# Altium schematic sheet RP_ComputeModule3_rev.3.0_USB.SchDoc
size A4 portrait
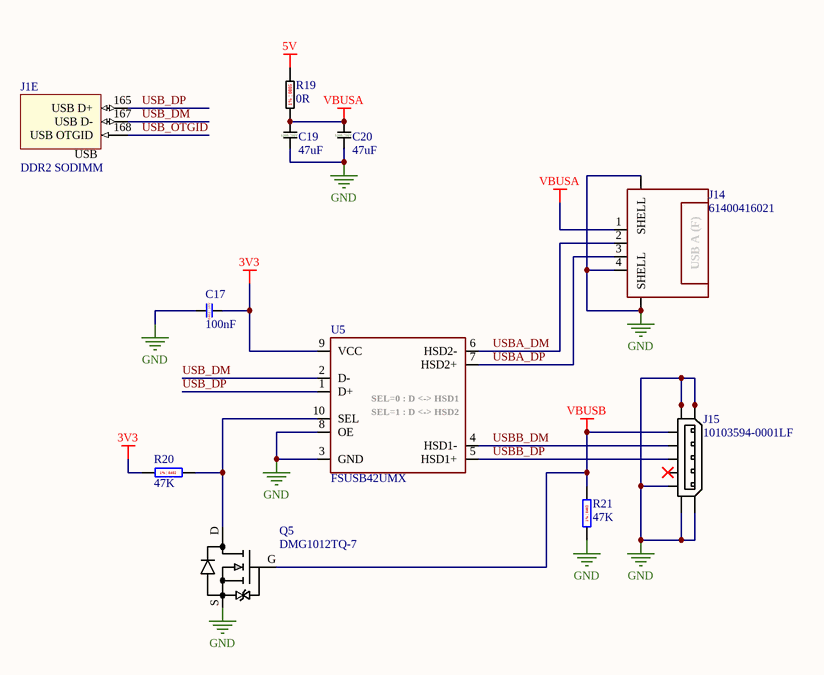
[diagram p0: RP_ComputeModule3_rev.3.0_USB.SchDoc]

## Parts
C17  100nF  [GJM 0402 C]
C19  47uF  [MURATA C1206 / CAPC3216X94N]
C20  47uF  [MURATA C1206 / CAPC3216X94N]
J1  DDR2 SODIMM  [TE 1473005-4 (DDR2 SO-DIMM)]  (part E of 14)
J14  61400416021  [WE USB connector 61400416021]
J15  10103594-0001LF  [FCI_10103594-0001LF]
Q5  DMG1012TQ-7  [Diodes SOT523]
R19  0R  [YAGEO RES0402]
R20  47K  [Vishay Beyschlag MCS0402]
R21  47K  [Vishay Beyschlag MCS0402]
U5  FSUSB42UMX  [Fairchild/OnSemi - UMLP (FSUSB42)]

## Nets
3V3: C17.1 R20.2 U5.9(VCC)
5V: R19.1
GND: C17.2 C19.1 C20.1 J14.4 J14.SHELL J14.SHELL2(SHELL) J15.1 J15.6 J15.7 J15.8 J15.9 J15.10 J15.11 Q5.S R21.2 U5.3(GND) U5.8(OE)
VBUSA: C19.2 C20.2 J14.1 R19.2
VBUSB: J15.5 Q5.G R21.1
USB_DM: J1.167(USB_D-) U5.2(D-)
USB_DP: J1.165(USB_D+) U5.1(D+)
USB_OTGID: J1.168(USB_OTGID)
USBA_DM: J14.2 U5.6(HSD2-)
USBA_DP: J14.3 U5.7(HSD2+)
USBB_DM: J15.4 U5.4(HSD1-)
USBB_DP: J15.3 U5.5(HSD1+)
NetQ5_D: Q5.D R20.1 U5.10(SEL)

Not connected (* = marked no-connect by the designer): J15 2*

## Notes on the sheet
- (in symbol 1473005-4, part E) USB
- (in symbol 61400416021) USB A (F)
- (in symbol AC0805FR-070RL) 1% | 0805
- (in symbol C3216JB1C476M160AB) 1206 | 16V
- (in symbol FSUSB42UMX) SEL=0 : D <-> HSD1; SEL=1 : D <-> HSD2
- (in symbol GRM155R71A104JA01D) 0402 | 10V
- (in symbol MCS04020C4702FE000) 1% | 0402

## Library data of the parts
C17 = GRM155R71A104JA01D: Multilayer Ceramic Capacitors MLCC - SMD/SMT 0402 0.1uF 10volts 5%; Manufacturer: Murata Electronics; Type: Chip Monolithic Ceramic Capacitor; Voltage Rating DC: 10 VDC; Capacitance - pF: 100000 pF; Dielectric: X7R; Supplier 1: Mouser; Manufacturer Part Number: GRM155R71A104JA01D; RoHS: RoHS Compliant; Category: Multilayer Ceramic Capacitors MLCC - SMD/SMT; Stock 1: 376; Pricing 1: 1=0.100, 10=0.024, 100=0.011, 500=0.008, 1000=0.006, 5000=0.005, 10000=0.004 (USD); Capacitance: 0.1 uF; Height: 0.5 mm; Length: 1 mm; Package / Case: 0402 (1005 metric); Packaging: Cut Tape; Product: General Type MLCCs; Series: GRM; Termination Style: SMD/SMT; Tolerance: 5 %; Width: 0.5 mm; Brand: Murata Electronics; Capacitance - nF: 100 nF; Case Code - in: 0402; Case Code - mm: 1005; Maximum Operating Temperature: + 125 C; Minimum Operating Temperature: - 55 C; Standard Pack Qty: 10000; RoHS - Mouser: Y; Minimum Order Quantity: 1; Reeling: True; ComponentLink1URL: https://www.mouser.com/ds/2/281/c02e-2905.pdf; ComponentLink1Description: https://www.mouser.com/ds/2/281/c02e-2905.pdf
C19 C20 = C3216JB1C476M160AB: 47µF ±20% 16V JB Ceramic Capacitor -25°C ~ 85°C Surface Mount, MLCC 1206 (3216 Metric) 0.126" L x 0.063" W (3.20mm x 1.60mm); Manufacturer: TDK; Supplier 1: Digi-Key; Manufacturer Part Number: C3216JB1C476M160AB; Stock 1: 203837; Pricing 1: 1=1.2, 10=0.949, 100=0.7116, 500=0.53762, 1000=0.47438 (USD); Mount: Surface Mount; Case/Package: 1206; Case Code (Metric): 3216; Case Code (Imperial): 1206; Dielectric Material: Ceramic; Min Operating Temperature: -25°C; Max Operating Temperature: 85°C; Package Quantity: 1; Packaging: Tape and Reel; Capacitance: 47uF; Tolerance: 20%; Voltage Rating: 16V; Termination: SMD/SMT; Composition: Ceramic; Voltage Rating (DC): 16V; Length: 0.126inch; Height: 1.6mm; Width: 0.063inch; Thickness: 0.069inch; Lead Free: Lead Free; ComponentLink1URL: https://product.tdk.com/en/products/common/pdf/mlcc_partnumber_description.pdf; ComponentLink1Description: https://product.tdk.com/en/products/common/pdf/mlcc_partnumber_description.pdf; ComponentLink2URL: http://product.tdk.com/en/catalog/datasheets/mlcc_commercial_general_en.pdf; ComponentLink2Description: http://product.tdk.com/en/catalog/datasheets/mlcc_commercial_general_en.pdf; ComponentLink3URL: http://www.mouser.com/ds/2/400/lcc_commercial_general_en-837201.pdf; ComponentLink3Description: http://www.mouser.com/ds/2/400/lcc_commercial_general_en-837201.pdf
J1 = 1473005-4: TE CONNECTIVITY / AMP         1473005-4             SOCKET IC, DIMM, DDR2, 1.8V, 200WAY; Number of Contacts: 200; Memory Type: SDRAM,DDR; Insulation Resistance: 250MR; PCB Mount Retention: With; Gender: Female; Contact Current Rating: 500mA; Circuit Application: Power; Connector System: Cable-to-Board; Sealable: No (Without); Pitch: 0.6mm; Row Spacing: 0.244inch; Stack Height: 5.2mm; Supplier 1: Digi-Key; Manufacturer: TE Connectivity; Manufacturer Part Number: 1473005-4; Stock 1: 3804; Pricing 1: 1=3.9, 10=3.744, 25=3.432, 50=3.276, 100=3.12, 250=2.73, 500=2.652, 1000=2.262, 2500=2.106 (USD); Mount: Surface Mount; Number of Pins: 200; Contact Material: Copper Alloy; Contact Plating: Gold; Housing Colour: Black; Housing Material: Thermoplastic; Insulation Material: Thermoplastic; Min Operating Temperature: -67°C; Max Operating Temperature: 185°C; Number of Rows: 2; Orientation: Right Angle; Termination: Solder; Packaging: Tray; Package Quantity: 20; Number of Positions: 200; Voltage Rating: 1.8V; Connector Type: Socket; Length: 71.5mm; Depth: 26mm; Radiation Hardening: No; ELV: Compliant; Flammability Rating: UL94 V-0; Lead Free: Lead Free; REACH SVHC: No SVHC; ComponentLink1URL: https://datasheet.ciiva.com/682/eng-cd-1473005-j2-682720.pdf; ComponentLink1Description: https://datasheet.ciiva.com/682/eng-cd-1473005-j2-682720.pdf; ComponentLink2URL: https://datasheet.ciiva.com/15171/getdatasheetpartid-99150-15171488.pdf; ComponentLink2Description: https://datasheet.ciiva.com/15171/getdatasheetpartid-99150-15171488.pdf; ComponentLink3URL: https://datasheet.ciiva.com/1105/582309-1105221.pdf; ComponentLink3Description: https://datasheet.ciiva.com/1105/582309-1105221.pdf; ComponentLink4URL: https://datasheet.ciiva.com/682/eng-cd-1473005-j2-682726.pdf; ComponentLink4Description: https://datasheet.ciiva.com/682/eng-cd-1473005-j2-682726.pdf; ComponentLink5URL: https://datasheet.ciiva.com/14156/04821302-14156311.pdf; ComponentLink5Description: https://datasheet.ciiva.com/14156/04821302-14156311.pdf; ComponentLink6URL: https://datasheet.ciiva.com/3136/eng-cd-1473005-j-3136060.pdf; ComponentLink6Description: https://datasheet.ciiva.com/3136/eng-cd-1473005-j-3136060.pdf; ComponentLink7URL: https://datasheet.ciiva.com/16380/eng-cd-1473005-j-16380909.pdf; ComponentLink7Description: https://datasheet.ciiva.com/16380/eng-cd-1473005-j-16380909.pdf; ComponentLink8URL: https://datasheet.ciiva.com/16651/eng-cd-1473005-j-16651646.pdf; ComponentLink8Description: https://datasheet.ciiva.com/16651/eng-cd-1473005-j-16651646.pdf
J14 = 61400416021: USB - A USB 2.0 Receptacle Connector 4 Position Through Hole, Right Angle, Horizontal; Manufacturer: Wurth Electronics; Connector Type: USB,Socket; Number of Contacts: 4; Current Rating: 1A; Voltage Rating: 30V; Number of Ports: 1; Insulation Resistance: 1GR; USB Standard: USB 2.0; Supplier 1: Mouser; Manufacturer Part Number: 61400416021; Stock 1: 1100; Pricing 1: 1=0.99, 10=0.874, 50=0.823, 100=0.739, 1000=0.672, 10000=0.672 (USD); Mount: Through Hole,Horizontal; Contact Plating: Gold; Contact Material: Copper Alloy; Colour: White; Min Operating Temperature: -40°C; Max Operating Temperature: 105°C; Packaging: Tray; Gender: Receptacle; Package Quantity: 60; Number of Positions: 4; Termination: Solder; Orientation: Right Angle; Length: 15.8mm; Width: 14.4mm; REACH SVHC: Unknown; Lead Free: Lead Free; Flammability Rating: UL94 V-0; ComponentLink1URL: https://datasheet.ciiva.com/851/61400416021-851760.pdf; ComponentLink1Description: https://datasheet.ciiva.com/851/61400416021-851760.pdf; ComponentLink2URL: https://datasheet.ciiva.com/1098/1712150-1098928.pdf; ComponentLink2Description: https://datasheet.ciiva.com/1098/1712150-1098928.pdf; ComponentLink3URL: https://datasheet.ciiva.com/4598/61400416021-63715-4598787.pdf; ComponentLink3Description: https://datasheet.ciiva.com/4598/61400416021-63715-4598787.pdf; ComponentLink4URL: https://datasheet.ciiva.com/11731/0900766b81023ab4-11731304.pdf; ComponentLink4Description: https://datasheet.ciiva.com/11731/0900766b81023ab4-11731304.pdf; ComponentLink5URL: https://datasheet.ciiva.com/1100/76585-1100559.pdf; ComponentLink5Description: https://datasheet.ciiva.com/1100/76585-1100559.pdf; ComponentLink6URL: https://datasheet.ciiva.com/14103/4257096-eng-datasheet-14103431.pdf; ComponentLink6Description: https://datasheet.ciiva.com/14103/4257096-eng-datasheet-14103431.pdf; ComponentLink7URL: https://datasheet.ciiva.com/48712/001088207-da-01-en-wr-com-usb-typ-a-61400416021-48712661.pdf; ComponentLink7Description: https://datasheet.ciiva.com/48712/001088207-da-01-en-wr-com-usb-typ-a-61400416021-48712661.pdf
J15 = 10103594-0001LF: USB - micro B USB 2.0 Receptacle Connector 5 Position Surface Mount, Right Angle, Horizontal; Manufacturer: Amphenol FCI; Voltage Rating: 100V; Current Rating: 1.8A; Connector Type: USB,Receptacle; Number of Ports: 1; Insulation Resistance: 1GR; Number of Contacts: 5; USB Standard: USB 2.0; Pitch: 0.65mm; Supplier 1: Mouser; Manufacturer Part Number: 10103594-0001LF; Stock 1: 28662; Pricing 1: 1=0.7, 10=0.522, 50=0.522, 100=0.501, 1000=0.359, 10000=0.294 (USD); Mount: Surface Mount,Horizontal; Contact Plating: Nickel,Gold; Contact Material: Copper,Copper Alloy; Number of Terminals: 5; Housing Material: Thermoplastic; Min Operating Temperature: -55°C; Max Operating Temperature: 85°C; Termination: Solder; Orientation: Right Angle; Gender: Receptacle; Packaging: Tape and Reel; Package Quantity: 1500; Max Voltage Rating (AC): 100V; Length: 8.04mm; Radiation Hardening: No; REACH SVHC: No SVHC; Lead Free: Lead Free; ComponentLink1URL: https://datasheet.ciiva.com/8015/10103594-8015248.pdf; ComponentLink1Description: https://datasheet.ciiva.com/8015/10103594-8015248.pdf; ComponentLink2URL: https://datasheet.ciiva.com/11731/0900766b80ed1ae4-11731328.pdf; ComponentLink2Description: https://datasheet.ciiva.com/11731/0900766b80ed1ae4-11731328.pdf; ComponentLink3URL: https://datasheet.ciiva.com/14618/70236822-14618885.pdf; ComponentLink3Description: https://datasheet.ciiva.com/14618/70236822-14618885.pdf; ComponentLink4URL: https://datasheet.ciiva.com/22654/1469075-22654519.pdf; ComponentLink4Description: https://datasheet.ciiva.com/22654/1469075-22654519.pdf; ComponentLink5URL: https://datasheet.ciiva.com/851/10103594-851115.pdf; ComponentLink5Description: https://datasheet.ciiva.com/851/10103594-851115.pdf; ComponentLink6URL: https://datasheet.ciiva.com/5726/10103594-5726971.pdf; ComponentLink6Description: https://datasheet.ciiva.com/5726/10103594-5726971.pdf; ComponentLink7URL: https://datasheet.ciiva.com/851/10103594-851116.pdf; ComponentLink7Description: https://datasheet.ciiva.com/851/10103594-851116.pdf; ComponentLink8URL: https://datasheet.ciiva.com/851/10103594-851117.pdf; ComponentLink8Description: https://datasheet.ciiva.com/851/10103594-851117.pdf
Q5 = DMG1012TQ-7: MOSFET NCH 20V 630MA SOT523; Manufacturer: Diodes; Rds On Max: 400mR; Input Capacitance: 60.67pF; Max Power Dissipation: 280mW; Supplier 1: Mouser; Manufacturer Part Number: DMG1012TQ-7; Stock 1: 11314; Pricing 1: 1=0.34, 10=0.225, 50=0.225, 100=0.094, 1000=0.064, 10000=0.043 (USD); Mount: Surface Mount; Case/Package: SOT-523; Number of Pins: 3; Min Operating Temperature: -55°C; Max Operating Temperature: 150°C; Packaging: Tape and Reel; Drain to Source Voltage (Vdss): 20V; Continuous Drain Current (ID): 630mA; ComponentLink1URL: http://www.mouser.com/ds/2/115/ds31783-892575.pdf; ComponentLink1Description: http://www.mouser.com/ds/2/115/ds31783-892575.pdf; ComponentLink2URL: https://www.diodes.com/assets/Datasheets/ds31783.pdf; ComponentLink2Description: https://www.diodes.com/assets/Datasheets/ds31783.pdf
R19 = AC0805FR-070RL: Thick Film Resistors - SMD 1/8W 0.0ohm 1%; Manufacturer: Yageo; Voltage Rating: 150V; Power Rating: 125mW; Resistance: 0mR; Temperature Coefficient: 200ppm/°C; Supplier 1: Mouser; Manufacturer Part Number: AC0805FR-070RL; Stock 1: 1027; Pricing 1: 1=0.16, 10=0.036, 50=0.036, 100=0.012, 1000=0.009, 10000=0.004 (USD); Mount: Surface Mount; Case/Package: 0805; Case Code (Imperial): 0805; Case Code (Metric): 2012; Min Operating Temperature: -55°C; Max Operating Temperature: 155°C; Tolerance: 1%; Packaging: Tape and Reel; Termination: SMD/SMT; Lead Free: Lead Free; ComponentLink1URL: https://datasheet.ciiva.com/12656/pyu-ac-51-rohs-l-2-12656890.pdf; ComponentLink1Description: https://datasheet.ciiva.com/12656/pyu-ac-51-rohs-l-2-12656890.pdf
R20 R21 = MCS04020C4702FE000: Res Thin Film 0402 47K Ohm 1% 1/16W ±50ppm/C Molded SMD Paper T/R; Manufacturer: Vishay BCcomponents; Resistance: 47kR; Temperature Coefficient: 50ppm/°C; Power Rating: 100mW; Voltage Rating: 50V; Supplier 1: Mouser; Manufacturer Part Number: MCS04020C4702FE000; Stock 1: 7724; Pricing 1: 1=0.11, 10=0.11, 50=0.076, 100=0.065, 1000=0.054, 10000=0.04 (USD); Case/Package: 0402; Contact Plating: Tin; Case Code (Metric): 1005; Case Code (Imperial): 0402; Min Operating Temperature: -55°C; Max Operating Temperature: 125°C; Tolerance: 1%; Composition: Thin Film; Packaging: Tape and Reel; Military Standard: Not; Voltage Rating (DC): 50V; Length: 1mm; Depth: 0.5mm; Width: 500um; Radiation Hardening: No; REACH SVHC: No SVHC; Lead Free: Lead Free; ComponentLink1URL: https://datasheet.ciiva.com/17178/mc-pro-17178488.pdf; ComponentLink1Description: https://datasheet.ciiva.com/17178/mc-pro-17178488.pdf; ComponentLink2URL: https://datasheet.ciiva.com/8900/mc-pro-8900138.pdf; ComponentLink2Description: https://datasheet.ciiva.com/8900/mc-pro-8900138.pdf
U5 = FSUSB42UMX: Analog Switch Single DPDT 10-Pin UMLP EP T/R; Manufacturer: ON Semiconductor / Fairchild; Min Supply Voltage: 3V; Max Supply Voltage: 4.3V; Nominal Supply Current: 1uA; Number of Inputs: 2; Number of Channels: 1; Data Rate: 480Mbps; Output Current: 100mA; Propagation Delay: 0.25ns; Bandwidth: 720MHz; Turn-Off Delay Time: 25ns; On-State Resistance: 6.5R; Turn-On Delay Time: 30ns; Supplier 1: Mouser; Manufacturer Part Number: FSUSB42UMX; Stock 1: 18559; Pricing 1: 1=0.57, 10=0.47, 50=0.47, 100=0.287, 1000=0.222, 10000=0.176 (USD); Mount: Surface Mount; Number of Pins: 10; Weight: 18.08g; Min Operating Temperature: -40°C; Max Operating Temperature: 85°C; Package Quantity: 1; Number of Outputs: 2; Packaging: Tape and Reel; Operating Supply Voltage: 4.3V; Number of Ports: 2; Termination: SMD/SMT; Throw Configuration: DPDT; Supply Type: Single; Length: 1.4mm; Height: 0.5mm; Width: 1.8mm; Radiation Hardening: No; REACH SVHC: No SVHC; Lead Free: Lead Free; ComponentLink1URL: https://datasheet.ciiva.com/15108/getdatasheetpartid-189033-15108996.pdf; ComponentLink1Description: https://datasheet.ciiva.com/15108/getdatasheetpartid-189033-15108996.pdf; ComponentLink2URL: https://datasheet.ciiva.com/1504/1815547-1504946.pdf; ComponentLink2Description: https://datasheet.ciiva.com/1504/1815547-1504946.pdf; ComponentLink3URL: https://datasheet.ciiva.com/26074/fsusb42-26074741.pdf; ComponentLink3Description: https://datasheet.ciiva.com/26074/fsusb42-26074741.pdf; ComponentLink4URL: https://datasheet.ciiva.com/1561/fsusb42-1561415.pdf; ComponentLink4Description: https://datasheet.ciiva.com/1561/fsusb42-1561415.pdf; ComponentLink5URL: https://datasheet.ciiva.com/3233/fsusb42-3233259.pdf; ComponentLink5Description: https://datasheet.ciiva.com/3233/fsusb42-3233259.pdf; ComponentLink6URL: https://datasheet.ciiva.com/6638/fsusb42-6638604.pdf; ComponentLink6Description: https://datasheet.ciiva.com/6638/fsusb42-6638604.pdf; ComponentLink7URL: https://datasheet.ciiva.com/6638/fsusb42-6638607.pdf; ComponentLink7Description: https://datasheet.ciiva.com/6638/fsusb42-6638607.pdf